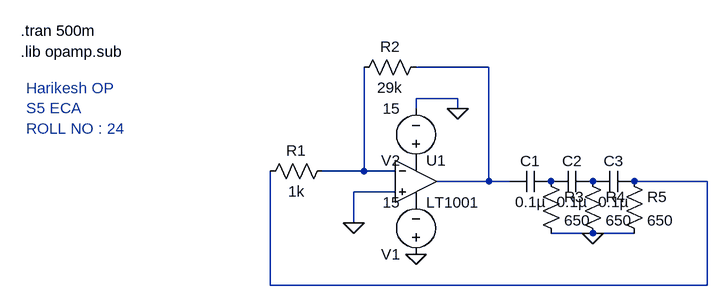
[diagram p0: schematic RC_PHASESHIFT.asc]
RC_PHASESHIFT.asc, the LTspice schematic file:
Version 4
SHEET 1 880 680
WIRE 336 -16 224 -16
WIRE 288 32 224 32
WIRE 224 48 224 32
WIRE 288 48 288 32
WIRE 144 144 144 -16
WIRE 144 144 80 144
WIRE 192 144 144 144
WIRE 336 160 336 -16
WIRE 336 160 256 160
WIRE 368 160 336 160
WIRE 672 160 560 160
WIRE 192 176 128 176
WIRE 128 224 128 176
WIRE 496 240 432 240
WIRE 560 240 496 240
WIRE 0 320 0 144
WIRE 672 320 672 160
WIRE 672 320 0 320
FLAG 288 48 0
FLAG 224 272 0
FLAG 128 224 0
FLAG 496 240 0
SYMBOL voltage 224 288 R180
WINDOW 123 0 0 Left 0
WINDOW 39 0 0 Left 0
SYMATTR InstName V1
SYMATTR Value 15
SYMBOL voltage 224 144 R180
WINDOW 123 0 0 Left 0
WINDOW 39 0 0 Left 0
SYMATTR InstName V2
SYMATTR Value 15
SYMBOL OpAmps\\LT1001 224 96 R0
SYMATTR InstName U1
SYMBOL res 96 128 R90
WINDOW 0 0 56 VBottom 2
WINDOW 3 32 56 VTop 2
SYMATTR InstName R1
SYMATTR Value 1k
SYMBOL res 240 -32 R90
WINDOW 0 0 56 VBottom 2
WINDOW 3 32 56 VTop 2
SYMATTR InstName R2
SYMATTR Value 29k
SYMBOL cap 432 144 R90
WINDOW 0 0 32 VBottom 2
WINDOW 3 32 32 VTop 2
SYMATTR InstName C1
SYMATTR Value 0.1µ
SYMBOL cap 496 144 R90
WINDOW 0 0 32 VBottom 2
WINDOW 3 32 32 VTop 2
SYMATTR InstName C2
SYMATTR Value 0.1µ
SYMBOL cap 560 144 R90
WINDOW 0 0 32 VBottom 2
WINDOW 3 32 32 VTop 2
SYMATTR InstName C3
SYMATTR Value 0.1µ
SYMBOL res 416 144 R0
SYMATTR InstName R3
SYMATTR Value 650
SYMBOL res 480 144 R0
SYMATTR InstName R4
SYMATTR Value 650
SYMBOL res 544 144 R0
SYMATTR InstName R5
SYMATTR Value 650
TEXT -384 -72 Left 2 !.tran 500m
TEXT -384 -40 Left 2 !.lib opamp.sub
TEXT -376 16 Left 2 ;Harikesh OP\nS5 ECA \nROLL NO : 24

The netlist it stands for:
* RC_PHASESHIFT.asc
V1 0 P001 15
V2 P002 0 15
XU1 0 N002 P002 P001 N001 LT1001  ; pins In+ In- V+ V- OUT
R1 N002 N003 1k
R2 N001 N002 29k
C1 P003 N001 0.1µ
C2 P004 P003 0.1µ
C3 N003 P004 0.1µ
R3 P003 0 650
R4 P004 0 650
R5 N003 0 650
.tran 500m
.lib opamp.sub
* Harikesh OP
* S5 ECA
* ROLL NO : 24
.lib LTC.lib
.backanno
.end